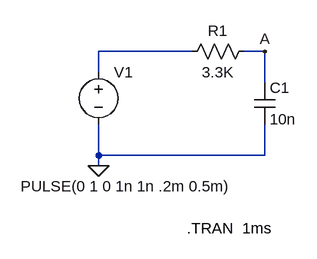
[diagram p0: schematic passabasso TRANS.asc]
passabasso TRANS.asc, the LTspice schematic file:
Version 4
SHEET 1 880 680
WIRE 32 112 -112 112
WIRE 144 112 112 112
WIRE -112 144 -112 112
WIRE 144 160 144 112
WIRE -112 272 -112 224
WIRE 144 272 144 224
WIRE 144 272 -112 272
WIRE -112 288 -112 272
FLAG -112 288 0
FLAG 144 112 A
SYMBOL voltage -112 128 R0
WINDOW 3 -120 191 Left 2
SYMATTR Value PULSE(0 1 0 1n 1n .2m 0.5m)
SYMATTR InstName V1
SYMATTR Value2 AC 0
SYMBOL res 128 96 R90
WINDOW 0 0 56 VBottom 2
WINDOW 3 32 56 VTop 2
SYMATTR InstName R1
SYMATTR Value 3.3K
SYMBOL cap 128 160 R0
SYMATTR InstName C1
SYMATTR Value 10n
TEXT 24 384 Left 2 !.TRAN  1ms

The netlist it stands for:
* passabasso TRANS.asc
V1 N001 0 PULSE(0 1 0 1n 1n .2m 0.5m) AC 0
R1 A N001 3.3K
C1 A 0 10n
.TRAN  1ms
.backanno
.end